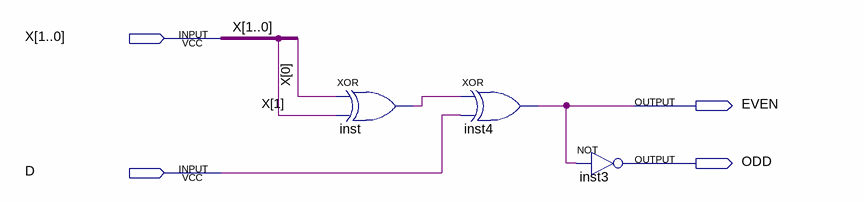
[diagram p0: schematic sheet]
// Quartus schematic 2_bit_even_odd.bdf as structural Verilog: 3 symbols, 4 pins
module \2_bit_even_odd  (
  input  [1:0] X,
  input  D,
  output EVEN,
  output ODD
);

  wire inst_out;

  xor inst (inst_out, X[0], X[1]);
  xor inst4 (EVEN, inst_out, D);
  not inst3 (ODD, EVEN);
endmodule
